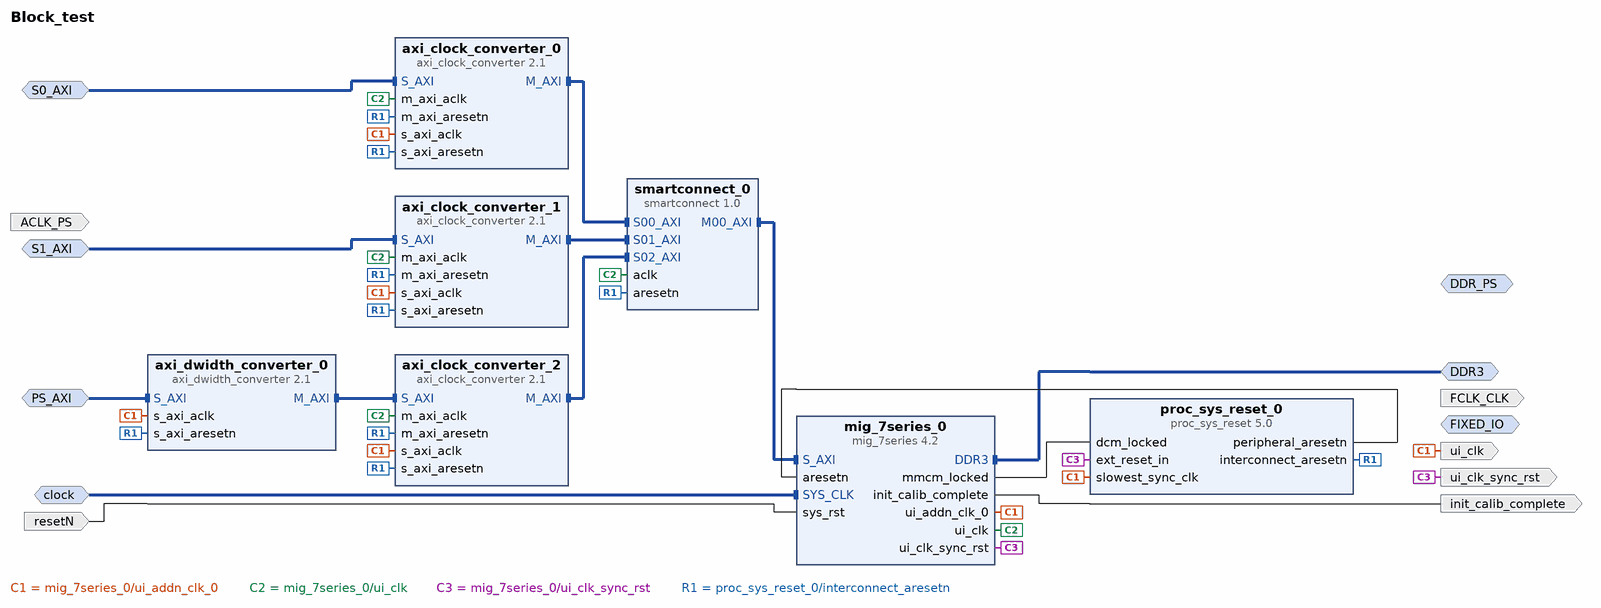
[diagram p0: block diagram of the top level]
# Vivado block design Block_test, xc7z100ffg900-2, Vivado 2018.3
create_bd_design Block_test

create_bd_intf_port -mode Master -vlnv xilinx.com:interface:ddrx_rtl:1.0 DDR3
create_bd_intf_port -mode Master -vlnv xilinx.com:interface:ddrx_rtl:1.0 DDR_PS
create_bd_intf_port -mode Master -vlnv xilinx.com:display_processing_system7:fixedio_rtl:1.0 FIXED_IO
create_bd_intf_port -mode Slave -vlnv xilinx.com:interface:aximm_rtl:1.0 PS_AXI
set_property -dict [list \
  CONFIG.ADDR_WIDTH 32 \
  CONFIG.ARUSER_WIDTH 0 \
  CONFIG.AWUSER_WIDTH 0 \
  CONFIG.BUSER_WIDTH 0 \
  CONFIG.DATA_WIDTH 64 \
  CONFIG.HAS_BRESP 1 \
  CONFIG.HAS_BURST 1 \
  CONFIG.HAS_CACHE 1 \
  CONFIG.HAS_LOCK 1 \
  CONFIG.HAS_PROT 1 \
  CONFIG.HAS_QOS 1 \
  CONFIG.HAS_REGION 1 \
  CONFIG.HAS_RRESP 1 \
  CONFIG.HAS_WSTRB 1 \
  CONFIG.ID_WIDTH 0 \
  CONFIG.MAX_BURST_LENGTH 256 \
  CONFIG.NUM_READ_OUTSTANDING 2 \
  CONFIG.NUM_READ_THREADS 1 \
  CONFIG.NUM_WRITE_OUTSTANDING 2 \
  CONFIG.NUM_WRITE_THREADS 1 \
  CONFIG.PROTOCOL AXI4 \
  CONFIG.READ_WRITE_MODE READ_WRITE \
  CONFIG.RUSER_BITS_PER_BYTE 0 \
  CONFIG.RUSER_WIDTH 0 \
  CONFIG.SUPPORTS_NARROW_BURST 1 \
  CONFIG.WUSER_BITS_PER_BYTE 0 \
  CONFIG.WUSER_WIDTH 0 \
  CONFIG.master_id 2 \
] [get_bd_intf_ports PS_AXI]
create_bd_intf_port -mode Slave -vlnv xilinx.com:interface:aximm_rtl:1.0 S0_AXI
set_property -dict [list \
  CONFIG.ADDR_WIDTH 32 \
  CONFIG.ARUSER_WIDTH 0 \
  CONFIG.AWUSER_WIDTH 0 \
  CONFIG.BUSER_WIDTH 0 \
  CONFIG.DATA_WIDTH 256 \
  CONFIG.HAS_BRESP 1 \
  CONFIG.HAS_BURST 1 \
  CONFIG.HAS_CACHE 1 \
  CONFIG.HAS_LOCK 1 \
  CONFIG.HAS_PROT 1 \
  CONFIG.HAS_QOS 1 \
  CONFIG.HAS_REGION 1 \
  CONFIG.HAS_RRESP 1 \
  CONFIG.HAS_WSTRB 1 \
  CONFIG.ID_WIDTH 0 \
  CONFIG.MAX_BURST_LENGTH 256 \
  CONFIG.NUM_READ_OUTSTANDING 1 \
  CONFIG.NUM_READ_THREADS 1 \
  CONFIG.NUM_WRITE_OUTSTANDING 1 \
  CONFIG.NUM_WRITE_THREADS 1 \
  CONFIG.PROTOCOL AXI4 \
  CONFIG.READ_WRITE_MODE READ_WRITE \
  CONFIG.RUSER_BITS_PER_BYTE 0 \
  CONFIG.RUSER_WIDTH 0 \
  CONFIG.SUPPORTS_NARROW_BURST 1 \
  CONFIG.WUSER_BITS_PER_BYTE 0 \
  CONFIG.WUSER_WIDTH 0 \
  CONFIG.master_id 0 \
] [get_bd_intf_ports S0_AXI]
create_bd_intf_port -mode Slave -vlnv xilinx.com:interface:aximm_rtl:1.0 S1_AXI
set_property -dict [list \
  CONFIG.ADDR_WIDTH 32 \
  CONFIG.ARUSER_WIDTH 0 \
  CONFIG.AWUSER_WIDTH 0 \
  CONFIG.BUSER_WIDTH 0 \
  CONFIG.DATA_WIDTH 256 \
  CONFIG.HAS_BRESP 1 \
  CONFIG.HAS_BURST 1 \
  CONFIG.HAS_CACHE 1 \
  CONFIG.HAS_LOCK 1 \
  CONFIG.HAS_PROT 1 \
  CONFIG.HAS_QOS 1 \
  CONFIG.HAS_REGION 1 \
  CONFIG.HAS_RRESP 1 \
  CONFIG.HAS_WSTRB 1 \
  CONFIG.ID_WIDTH 0 \
  CONFIG.MAX_BURST_LENGTH 256 \
  CONFIG.NUM_READ_OUTSTANDING 1 \
  CONFIG.NUM_READ_THREADS 1 \
  CONFIG.NUM_WRITE_OUTSTANDING 1 \
  CONFIG.NUM_WRITE_THREADS 1 \
  CONFIG.PROTOCOL AXI4 \
  CONFIG.READ_WRITE_MODE READ_WRITE \
  CONFIG.RUSER_BITS_PER_BYTE 0 \
  CONFIG.RUSER_WIDTH 0 \
  CONFIG.SUPPORTS_NARROW_BURST 1 \
  CONFIG.WUSER_BITS_PER_BYTE 0 \
  CONFIG.WUSER_WIDTH 0 \
  CONFIG.master_id 1 \
] [get_bd_intf_ports S1_AXI]
create_bd_intf_port -mode Slave -vlnv xilinx.com:interface:diff_clock_rtl:1.0 clock
set_property -dict {CONFIG.FREQ_HZ 200000000} [get_bd_intf_ports clock]
create_bd_port -dir I -type clk ACLK_PS
set_property -dict {CONFIG.FREQ_HZ 150000000} [get_bd_ports ACLK_PS]
create_bd_port -dir O -type clk FCLK_CLK
set_property -dict {CONFIG.FREQ_HZ 150000000} [get_bd_ports FCLK_CLK]
create_bd_port -dir O init_calib_complete
create_bd_port -dir I -type rst resetN
create_bd_port -dir O -type clk ui_clk
set_property -dict {CONFIG.ASSOCIATED_BUSIF S1_AXI:PS_AXI:S0_AXI} [get_bd_ports ui_clk]
create_bd_port -dir O -type rst ui_clk_sync_rst

create_bd_cell -type ip -vlnv xilinx.com:ip:axi_clock_converter:2.1 axi_clock_converter_0
set_property -dict {CONFIG.DATA_WIDTH 256} [get_bd_cells axi_clock_converter_0]
create_bd_cell -type ip -vlnv xilinx.com:ip:axi_clock_converter:2.1 axi_clock_converter_1
set_property -dict {CONFIG.DATA_WIDTH 256} [get_bd_cells axi_clock_converter_1]
create_bd_cell -type ip -vlnv xilinx.com:ip:proc_sys_reset:5.0 proc_sys_reset_0
set_property -dict {CONFIG.C_AUX_RESET_HIGH 0} [get_bd_cells proc_sys_reset_0]
create_bd_cell -type ip -vlnv xilinx.com:ip:smartconnect:1.0 smartconnect_0
set_property -dict {CONFIG.NUM_SI 3} [get_bd_cells smartconnect_0]
create_bd_cell -type ip -vlnv xilinx.com:ip:mig_7series:4.2 mig_7series_0
set_property -dict [list \
  CONFIG.BOARD_MIG_PARAM Custom \
  CONFIG.MIG_DONT_TOUCH_PARAM Custom \
  CONFIG.RESET_BOARD_INTERFACE Custom \
  CONFIG.XML_INPUT_FILE mig_a.prj \
] [get_bd_cells mig_7series_0]
create_bd_cell -type ip -vlnv xilinx.com:ip:axi_clock_converter:2.1 axi_clock_converter_2
set_property -dict {CONFIG.DATA_WIDTH 256} [get_bd_cells axi_clock_converter_2]
create_bd_cell -type ip -vlnv xilinx.com:ip:axi_dwidth_converter:2.1 axi_dwidth_converter_0
set_property -dict {CONFIG.MAX_SPLIT_BEATS 256 CONFIG.MI_DATA_WIDTH 256} [get_bd_cells axi_dwidth_converter_0]

# ---- connections ----

connect_bd_intf_net [get_bd_intf_ports S0_AXI] [get_bd_intf_pins axi_clock_converter_0/S_AXI]
connect_bd_intf_net [get_bd_intf_pins smartconnect_0/M00_AXI] [get_bd_intf_pins mig_7series_0/S_AXI]
connect_bd_intf_net [get_bd_intf_ports clock] [get_bd_intf_pins mig_7series_0/SYS_CLK]
connect_bd_intf_net [get_bd_intf_ports DDR3] [get_bd_intf_pins mig_7series_0/DDR3]
connect_bd_intf_net [get_bd_intf_pins smartconnect_0/S01_AXI] [get_bd_intf_pins axi_clock_converter_1/M_AXI]
connect_bd_intf_net [get_bd_intf_pins axi_clock_converter_2/M_AXI] [get_bd_intf_pins smartconnect_0/S02_AXI]
connect_bd_intf_net [get_bd_intf_ports PS_AXI] [get_bd_intf_pins axi_dwidth_converter_0/S_AXI]
connect_bd_intf_net [get_bd_intf_ports S1_AXI] [get_bd_intf_pins axi_clock_converter_1/S_AXI]
connect_bd_intf_net [get_bd_intf_pins smartconnect_0/S00_AXI] [get_bd_intf_pins axi_clock_converter_0/M_AXI]
connect_bd_intf_net [get_bd_intf_pins axi_dwidth_converter_0/M_AXI] [get_bd_intf_pins axi_clock_converter_2/S_AXI]
connect_bd_net [get_bd_pins mig_7series_0/init_calib_complete] [get_bd_ports init_calib_complete]
connect_bd_net [get_bd_pins mig_7series_0/mmcm_locked] [get_bd_pins proc_sys_reset_0/dcm_locked]
connect_bd_net [get_bd_pins mig_7series_0/ui_addn_clk_0] \
  [get_bd_pins proc_sys_reset_0/slowest_sync_clk] [get_bd_ports ui_clk] [get_bd_pins axi_clock_converter_1/s_axi_aclk] \
  [get_bd_pins axi_clock_converter_0/s_axi_aclk] [get_bd_pins axi_clock_converter_2/s_axi_aclk] \
  [get_bd_pins axi_dwidth_converter_0/s_axi_aclk]
connect_bd_net [get_bd_pins mig_7series_0/ui_clk] \
  [get_bd_pins smartconnect_0/aclk] [get_bd_pins axi_clock_converter_1/m_axi_aclk] \
  [get_bd_pins axi_clock_converter_0/m_axi_aclk] [get_bd_pins axi_clock_converter_2/m_axi_aclk]
connect_bd_net [get_bd_pins mig_7series_0/ui_clk_sync_rst] [get_bd_ports ui_clk_sync_rst] [get_bd_pins proc_sys_reset_0/ext_reset_in]
connect_bd_net [get_bd_pins proc_sys_reset_0/interconnect_aresetn] \
  [get_bd_pins smartconnect_0/aresetn] [get_bd_pins axi_clock_converter_1/s_axi_aresetn] \
  [get_bd_pins axi_clock_converter_1/m_axi_aresetn] [get_bd_pins axi_clock_converter_0/m_axi_aresetn] \
  [get_bd_pins axi_clock_converter_0/s_axi_aresetn] [get_bd_pins axi_clock_converter_2/s_axi_aresetn] \
  [get_bd_pins axi_clock_converter_2/m_axi_aresetn] [get_bd_pins axi_dwidth_converter_0/s_axi_aresetn]
connect_bd_net [get_bd_pins proc_sys_reset_0/peripheral_aresetn] [get_bd_pins mig_7series_0/aresetn]
connect_bd_net -net resetn_0_1 [get_bd_ports resetN] [get_bd_pins mig_7series_0/sys_rst]

# ---- address map ----
assign_bd_address -offset 0x80000000 -range 1G -target_address_space [get_bd_addr_spaces PS_AXI] [get_bd_addr_segs mig_7series_0/memmap/memaddr]
assign_bd_address -offset 0x80000000 -range 1G -target_address_space [get_bd_addr_spaces S0_AXI] [get_bd_addr_segs mig_7series_0/memmap/memaddr]
assign_bd_address -offset 0x80000000 -range 1G -target_address_space [get_bd_addr_spaces S1_AXI] [get_bd_addr_segs mig_7series_0/memmap/memaddr]

validate_bd_design
save_bd_design
